# EAGLE design Eagle_SoundSensor (EAGLE 7.2.0)
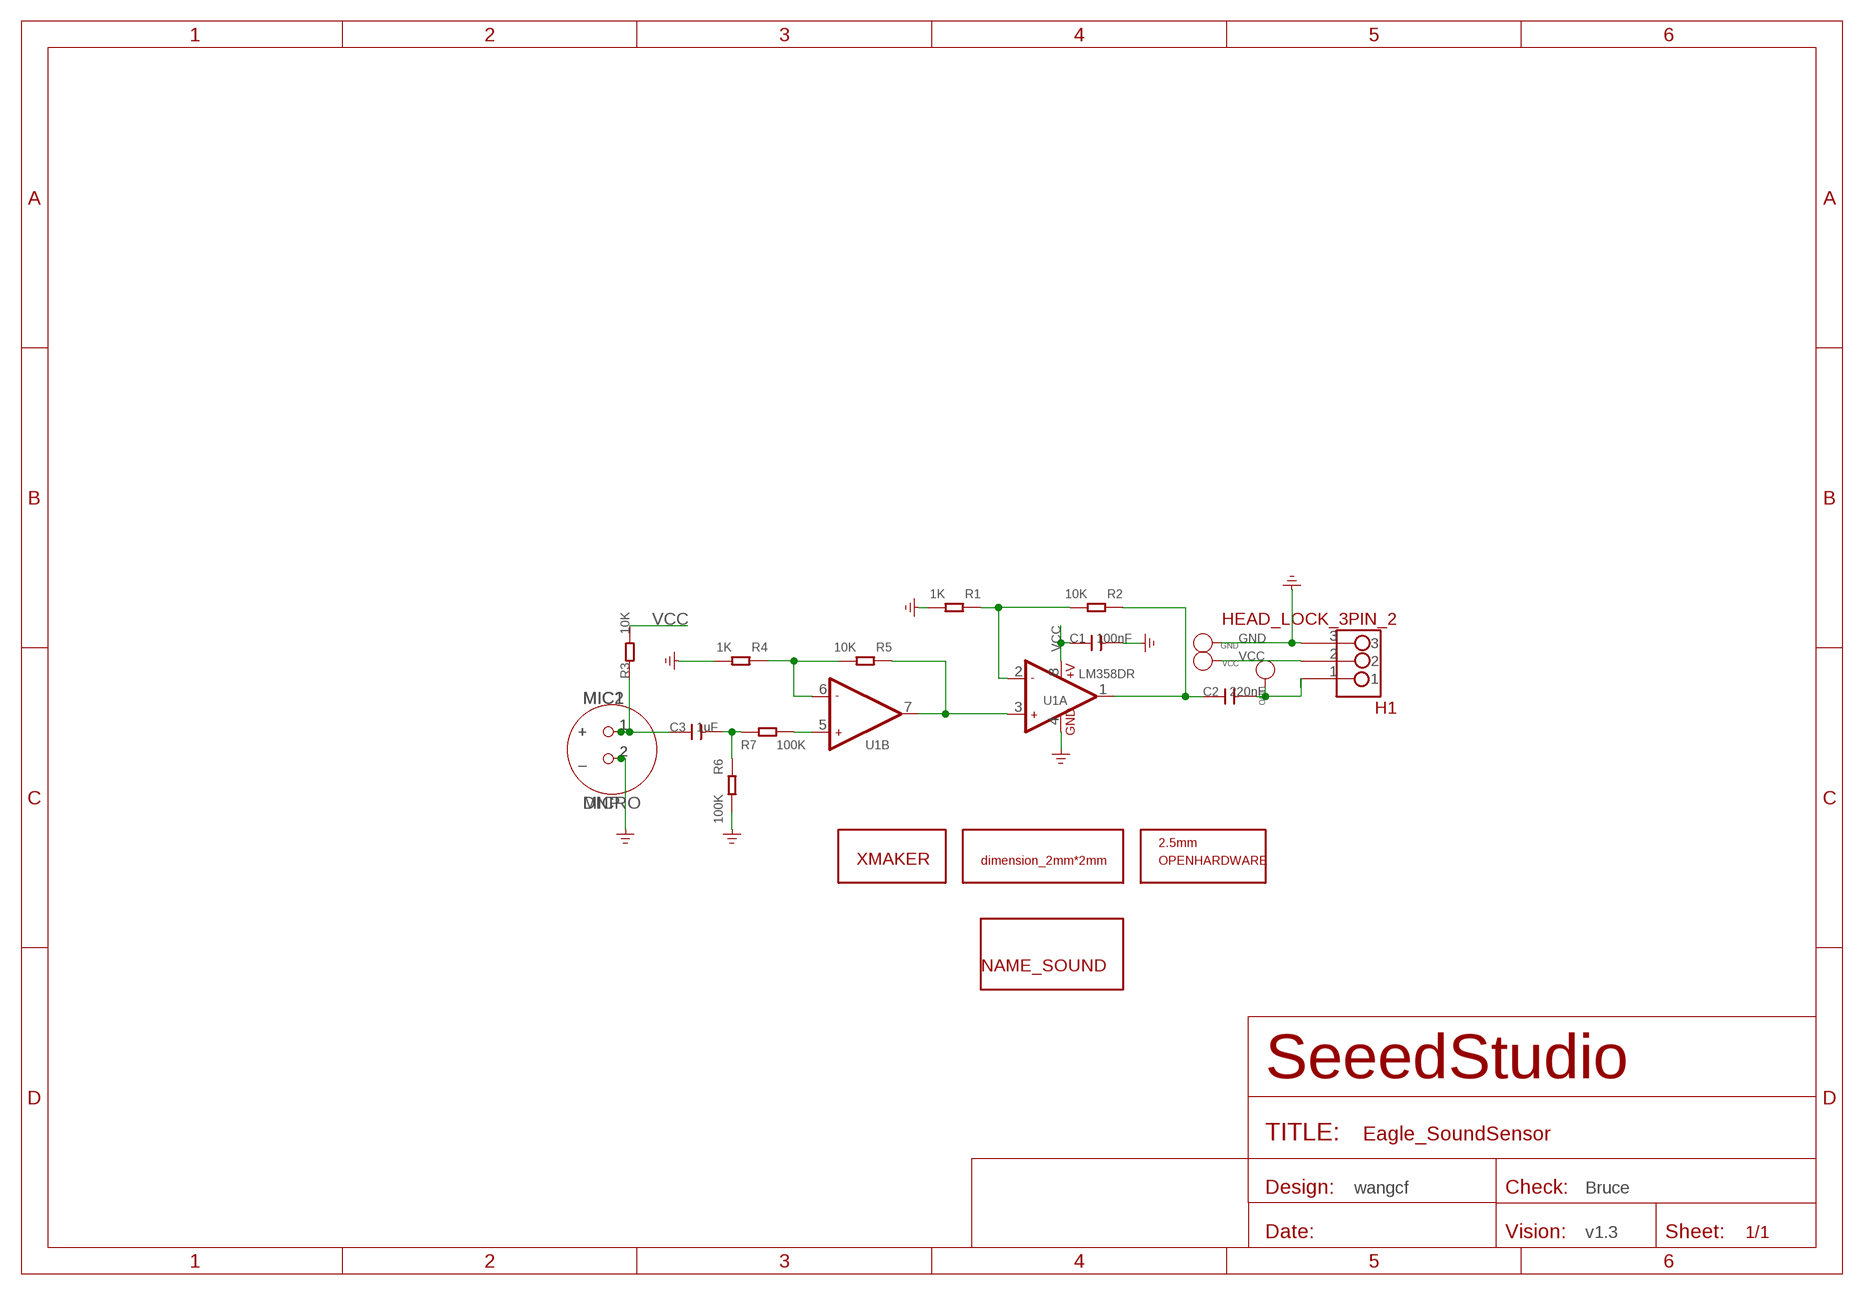
[diagram p0: schematic, sheet 1]

## Parts
C1  100nF  C-0603  [C0603]
C2  220nF  C-0603  [C0603]
C3  1uF  C-0603  [C0603]
GND  PAD-TEST-POINT'4545'  [TP_4545]
H1  HEAD_LOCK_3PIN_2  [HEAD_LOCK_3PIN_2]
MIC1  MICRO  [MICRO]
MIC2  DNP  MICRO  [MICRO]
OUT  PAD-TEST-POINT'4545'  [TP_4545]
R1  1K  R-0603  [R0603]
R2  10K  R-0603  [R0603]
R3  10K  R-0603  [R0603]
R4  1K  R-0603  [R0603]
R5  10K  R-0603  [R0603]
R6  100K  R-0603  [R0603]
R7  100K  R-0603  [R0603]
U1  LM358DR  LMV358D  [SO08]
U$7  XMAKERLOGO  [XMAKERLOGO]
U$11  DIMENSION_2MM2MM  [DIMENSION_2MM*2MM]
U$12  OPENHARDWARE_2.5MM_TOP  [OPENSOURCELOGO_2.5MM]
U$13  NAME_SOUND  [NAME_SOUND]
VCC  PAD-TEST-POINT'4545'  [TP_4545]

## Nets
GND: C1.2 GND.T H1.3 MIC1.2(_) MIC2.2(_) R1.2 R4.2 R6.2 U1.4(A:GND)
N$1: R7.2 U1.5(B:+IN2)
N$2: R4.1 R5.2 U1.6(B:-IN2)
N$3: C3.2 R6.1 R7.1
N$7: C3.1 MIC1.1(+) MIC2.1(+) R3.1
N$12: R5.1 U1.3(A:+IN1) U1.7(B:OUT2)
N$16: R1.1 R2.2 U1.2(A:-IN1)
OUT: C2.2 H1.1 OUT.T
OUT1: C2.1 R2.1 U1.1(A:OUT1)
VCC: C1.1 H1.2 R3.2 U1.8(A:+V) VCC.T

## Notes on the sheet
- wangcf | Bruce
- v1.3

## Library data of the parts
C1-C3 = Discrete:C*: Ceramic Capacitors
GND OUT VCC = Discrete:PAD-TEST-POINT; PARTNO: DNP
H1 = Xmaker:HEAD_LOCK_3PIN_2
MIC1 MIC2 = seeedleo:MICRO
R1-R7 = Discrete:R*
U1 = IC:LMV358: General purpose LOW Voltage, Rail-to-Rail Output Amplifiers http://www.fairchildsemi.com/ds/LM/LMV358.pdf
U$7 = Xmaker_yuhui:XMAKERLOGO
U$11 = Xmaker:DIMENSION_2MM*2MM
U$12 = Xmaker:OPENHARDWARE_2.5MM_TOP
U$13 = Xmaker:NAME_SOUND

## Net classes
0 default: width 0.152 mm, drill 0.305 mm, clearance 0.152 mm

## Board
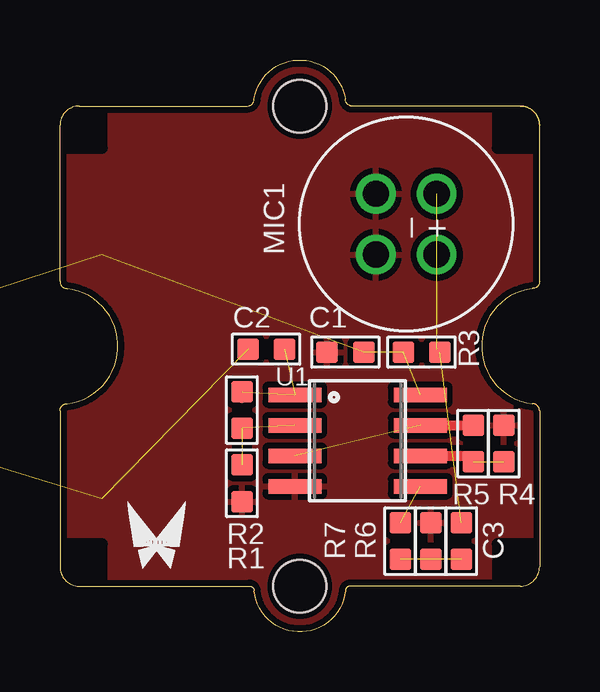
[diagram p1: board, top side]
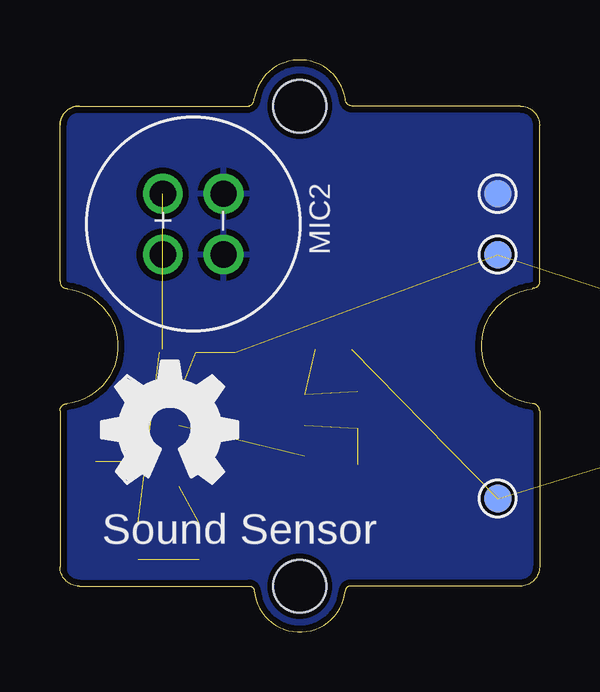
[diagram p2: board, bottom side, seen from below]

Size 20 x 23.83 mm. Coordinates in mm from the lower left corner, seen from the top.
Copper layers (1*16): Top 0.035mm / dielectric 1.5mm / Bottom 0.035mm
Design rules "SeeedStudio_rule_no_angle_090911 *": minimum track width 6mil, minimum drill 12mil, track to track 6mil, track to pad 6mil, pad to pad 6mil, via to via 6mil, smd to smd 0mil, copper to edge 10mil, drill to drill 10mil, minimum pad ring 10mil, minimum via ring 6mil, stop-mask expansion 2mil, vias tented up to drill 100mil, thermal gap 10mil

### Footprints (pad centres in the part's own frame; a part is rotated, then mirrored left to right if it is on the bottom)
C0603 = smd 0.889 x 0.889: 1 -0.762,0; 2 0.762,0
TP_4545 = smd 1.143 x 1.143: T 0,0
HEAD_LOCK_3PIN_2 = drill 0.8 square: 1 0,2.54 | drill 0.8: 2 0,0; 3 0,-2.54
MICRO = drill 1.1: 1 -1.27,1.27; 2 -1.27,-1.27
R0603 = smd 0.889 x 0.889: 1 -0.762,0; 2 0.762,0
SO08 = smd 0.61 x 2.21: 1 -1.905,-2.616; 2 -0.635,-2.616; 3 0.635,-2.616; 4 1.905,-2.616; 5 1.905,2.616; 6 0.635,2.616; 7 -0.635,2.616; 8 -1.905,2.616
1U-DIM-W/-DRILL = hole 2.2: 0,-10; 0,10

### Placement (x,y rotation side)
C1  11.91,11.65 180 top
C2  8.6,11.78 180 top
C3  16.73,3.78 270 top
GND  1.75,18.26 0 bottom
H1  -10.32,11.78 180 top  (outside the outline)
MIC1  14.45,16.99 270 top
MIC2  14.45,16.99 90 bottom
OUT  1.75,5.56 0 bottom
R1  7.59,6.19 270 top
R2  7.59,9.24 270 top
R3  15.08,11.65 180 top
R4  18.51,7.84 90 top
R5  17.24,7.84 270 top
R6  15.46,3.78 90 top
R7  14.19,3.78 90 top
U1  12.41,7.97 270 top
U$1  [OSHW_FILLX200_NOTEXT]  18.26,6.19 0 bottom
U$4  [1U-DIM-W/-DRILL]  10,11.91 0 top
U$7  2.13,2.13 0 top
U$11  35.78,0.99 0 top  (outside the outline)
U$12  -37.75,-11.84 0 top  (outside the outline)
U$13  -36.74,-15.9 0 top  (outside the outline)
VCC  1.75,15.72 0 bottom

### Tracks (layer width: path | path; a pad name or v marks a point on that pad's centre or on a via)
GND  (15 unrouted)
  pour Top (isolate 0.254): -0.79,24.61 20.8,24.61 20.8,-0.79 -0.79,-0.79
  pour Bottom (isolate 0.254): -0.79,24.61 20.8,24.61 20.8,-0.79 -0.79,-0.79
N$1  (1 unrouted)
N$2  (1 unrouted)
  Top 0.406: U1.6 16.98,7.34 R5.2
N$3  (2 unrouted)
N$7  (3 unrouted)
  Top 0.406: 15.71,11.78 R3.1
N$12  (1 unrouted)
  Top 0.406: U1.7 R5.1
N$16  (2 unrouted)
OUT  (2 unrouted)
OUT1  (2 unrouted)
  Top 0.406: 7.59,9.75 R2.1
VCC  (4 unrouted)

### Text on the board
bPlace: Sound Sensor